# Altium schematic sheet CATS-EUROC-Radio_MCU.SchDoc: CATS EuRoC Edition
size A4; Author: Luca Jost; Revision: V1.0; SheetNumber: 12; SheetTotal: 16; Subtitle: Radio Microprocessor
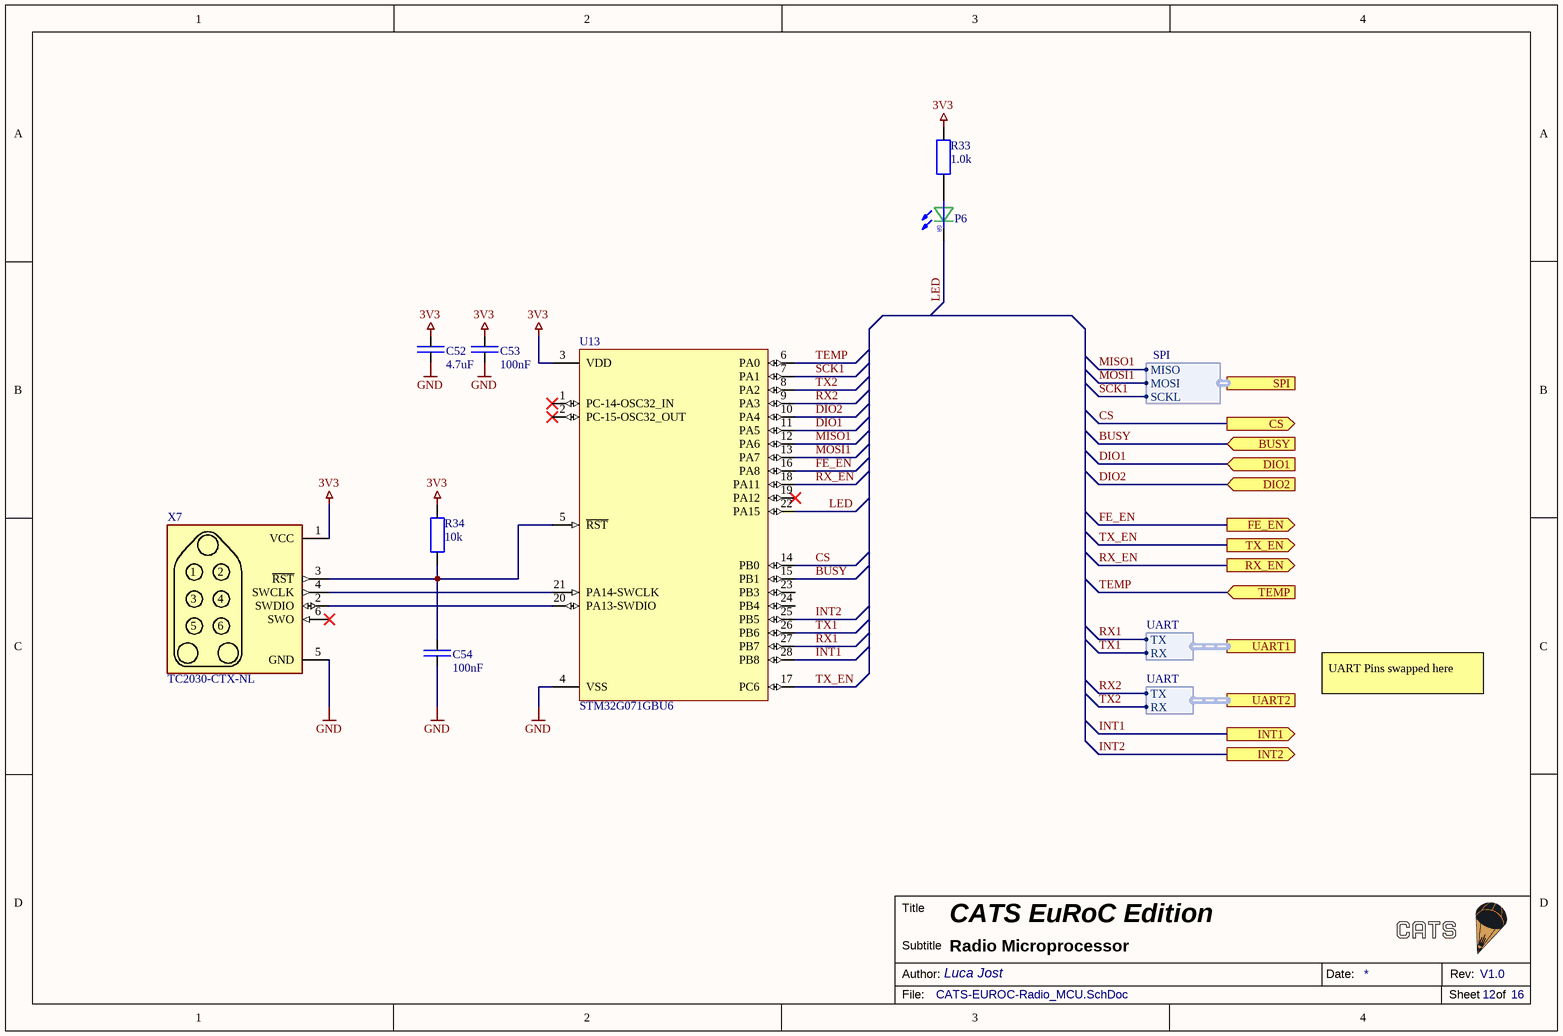
[diagram p0: CATS-EUROC-Radio_MCU.SchDoc]

## Parts
C52  4.7uF  [SMD Keramikkondensator 0402]
C53  100nF  [SMD Keramikkondensator 0402]
C54  100nF  [SMD Keramikkondensator 0402]
P6  LED  [SMD LED 0603]  (value not drawn)
R33  1.0k  [SMD Widerstand 0402]
R34  10k  [SMD Widerstand 0402]
U13  STM32G071GBU6  [SMD IC QFN-28 4x4]
X7  TC2030-CTX-NL  [SMD Connector TC2030]  (no BOM)

## Ports
BUSY (in), CS (out), DIO1 (in), DIO2 (in), FE_EN (out), INT1 (out), INT2 (out), RX_EN (out), SPI (harness SPI), TEMP (in), TX_EN (out), UART1 (harness UART), UART2 (harness UART)

## Harnesses
SPI: SCKL, MOSI, MISO
UART: TX, RX

## Nets
3V3: C52.2 C53.2 R33.2 R34.2 U13.3(VDD) X7.1(VCC)
GND: C52.1 C53.1 C54.1 U13.4(VSS) X7.5(GND)
BUSY: U13.15(PB1) ; port BUSY
CS: U13.14(PB0) ; port CS
DIO1: U13.11(PA5) ; port DIO1
DIO2: U13.10(PA4) ; port DIO2
FE_EN: U13.16(PA8) ; port FE_EN
INT1: U13.28(PB8) ; port INT1
INT2: U13.25(PB5) ; port INT2
LED: P6.K U13.22(PA15)
MISO1: U13.12(PA6) ; port SPI.MISO
MOSI1: U13.13(PA7) ; port SPI.MOSI
RX1: U13.27(PB7) ; port UART1.TX
RX2: U13.9(PA3) ; port UART2.TX
RX_EN: U13.18(PA11) ; port RX_EN
SCK1: U13.7(PA1) ; port SPI.SCKL
TEMP: U13.6(PA0) ; port TEMP
TX1: U13.26(PB6) ; port UART1.RX
TX2: U13.8(PA2) ; port UART2.RX
TX_EN: U13.17(PC6) ; port TX_EN
NetC54_2: C54.2 R34.1 U13.5(~{RST}) X7.3(~{RST})
NetP6_A: P6.A R33.1
NetU13_20: U13.20(PA13-SWDIO) X7.2(SWDIO)
NetU13_21: U13.21(PA14-SWCLK) X7.4(SWCLK)

Not connected (* = marked no-connect by the designer): U13 1(PC-14-OSC32_IN)* 2(PC-15-OSC32_OUT)* 19(PA12)* 23(PB3) 24(PB4); X7 6(SWO)*

## Notes on the sheet
- UART Pins swapped here
- Title
- Author:
- Subtitle
- Date:
- Rev:
- File:
- Sheet
- of
- (in symbol LED) GR

## Library data of the parts
C52 = E6 - 4.7uF: SMD Ceramic Capacitor E6; Unit Price: 0.01; Number: -; Supplier: -; JLC: C23733
C53 C54 = E6 - 100nF: SMD Ceramic Capacitor E6; Unit Price: 0.01; Number: -; Supplier: -; JLC: C307331
P6 = LED: Color LED
R33 = E24 - 1.0k: SMD Chip Resistor E24; Unit Price: 0.01; Number: -; Supplier: -; JLC: C11702
R34 = E24 - 10k: SMD Chip Resistor E24; Unit Price: 0.01; Number: -; Supplier: -; JLC: C25744
U13 = STM32G071GBU6: ARM® Cortex®-M0+ series Microcontroller IC 32-Bit 64MHz 128KB (128K x 8) FLASH 28-UFQFPN (4x4); Digikey: 497-18343-ND; JLC: C529347; ComponentLink1Description: Datasheet; ComponentLink1URL: https://media.digikey.com/pdf/Data%20Sheets/ST%20Microelectronics%20PDFS/STM32G071_Rev1_DS.pdf
X7 = TC2030-CTX-NL: Tag-Connect for ARM-Cortex (6-Pin)